# EAGLE board avr32break120828 (EAGLE 5.11), part 1 of 2
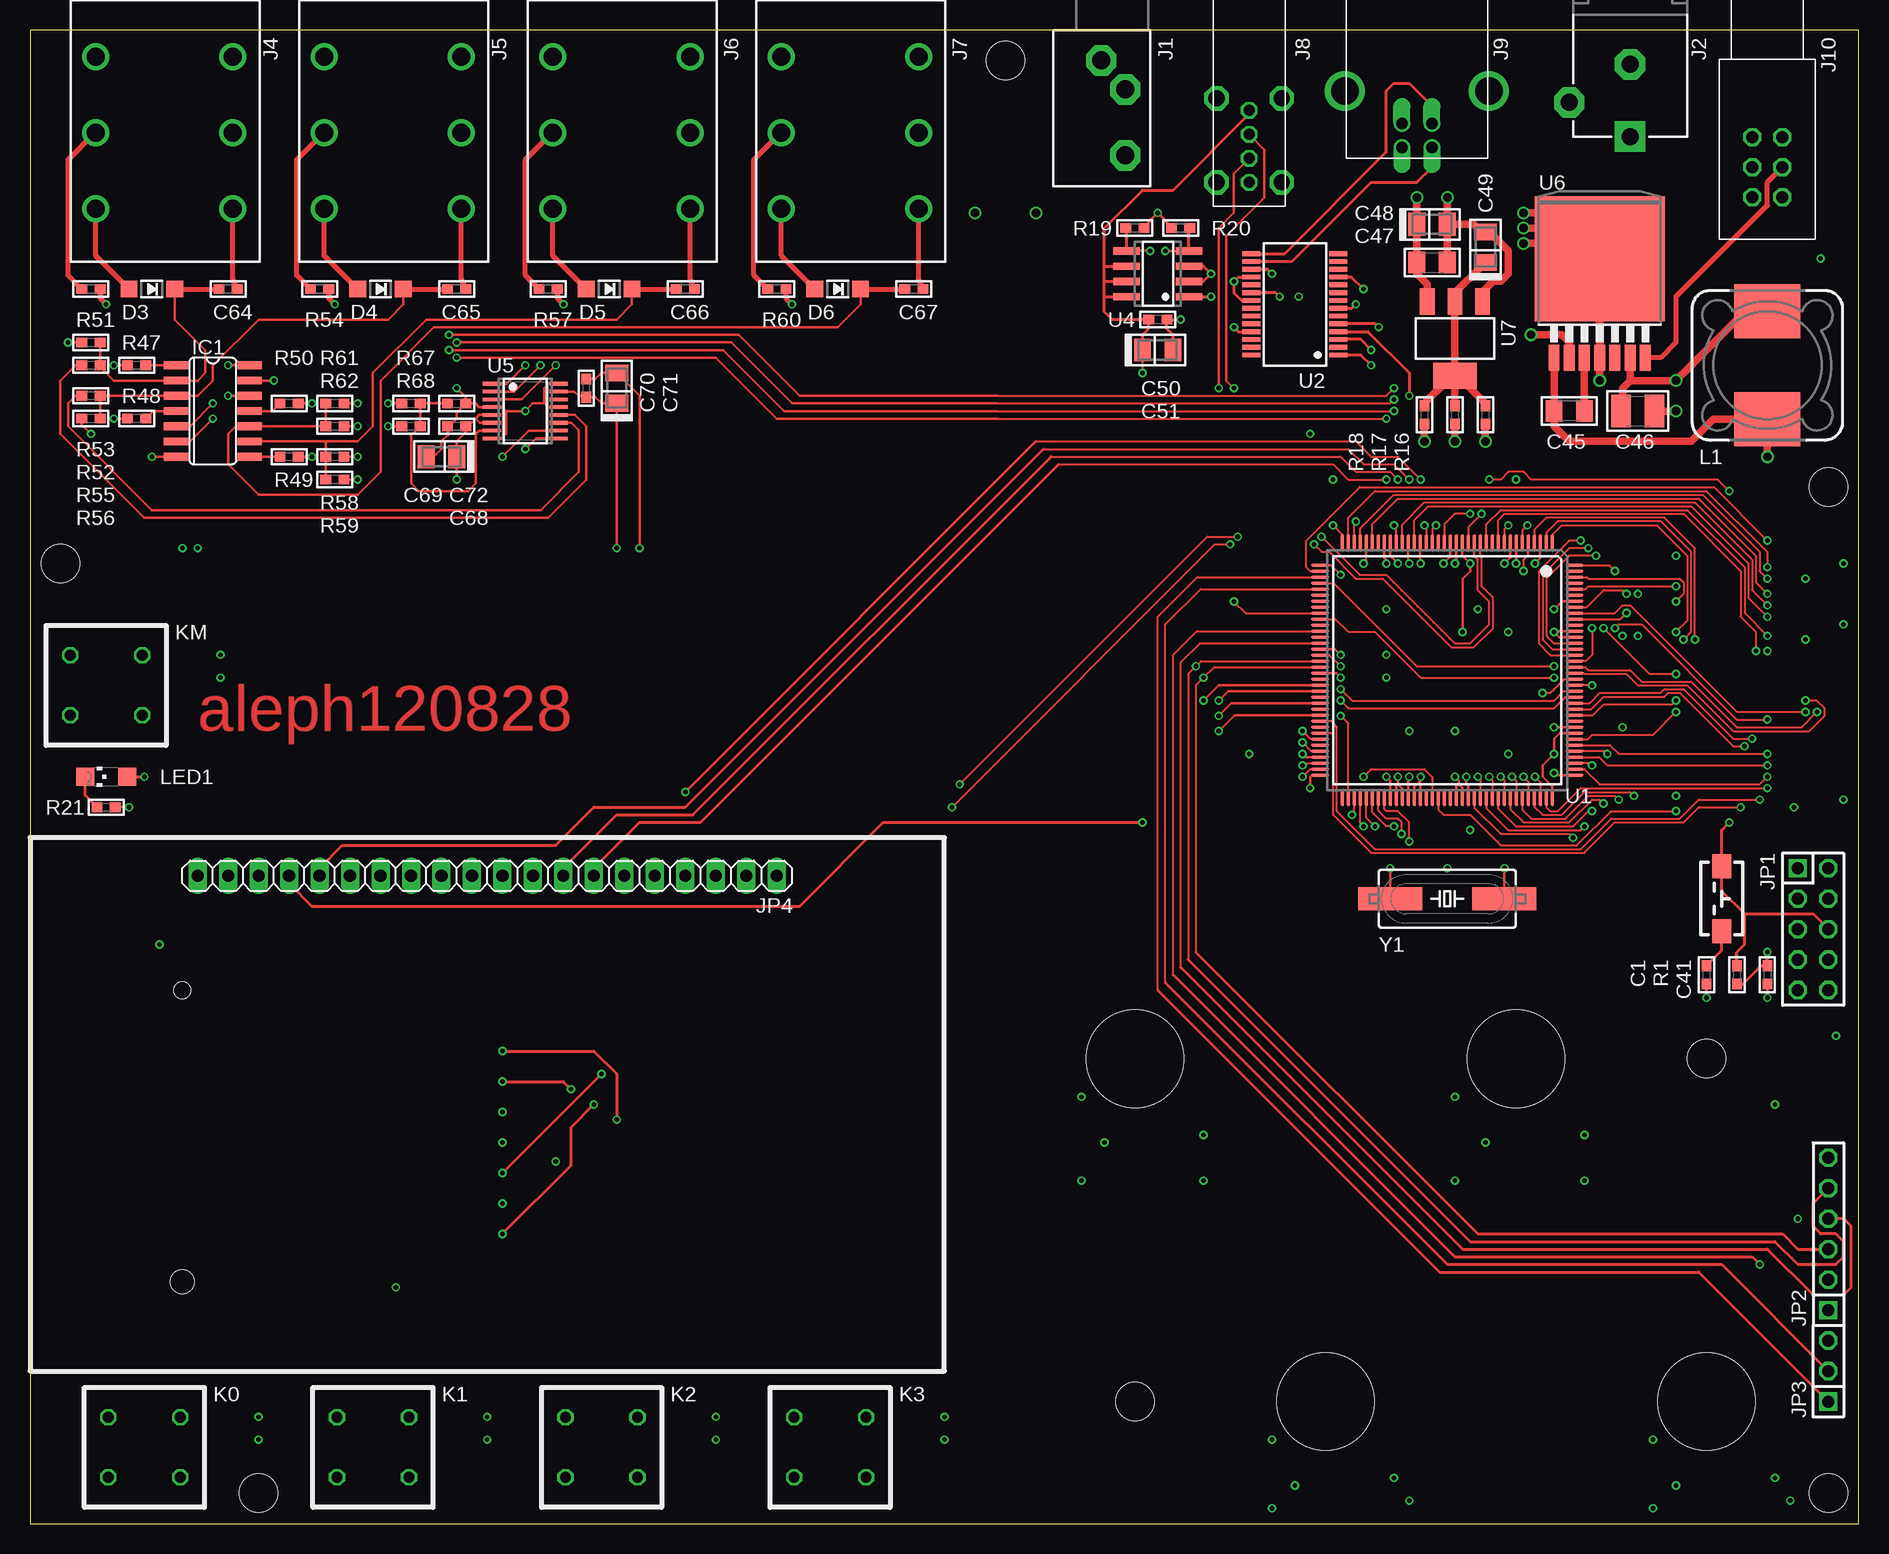
[diagram p3: board, top side]
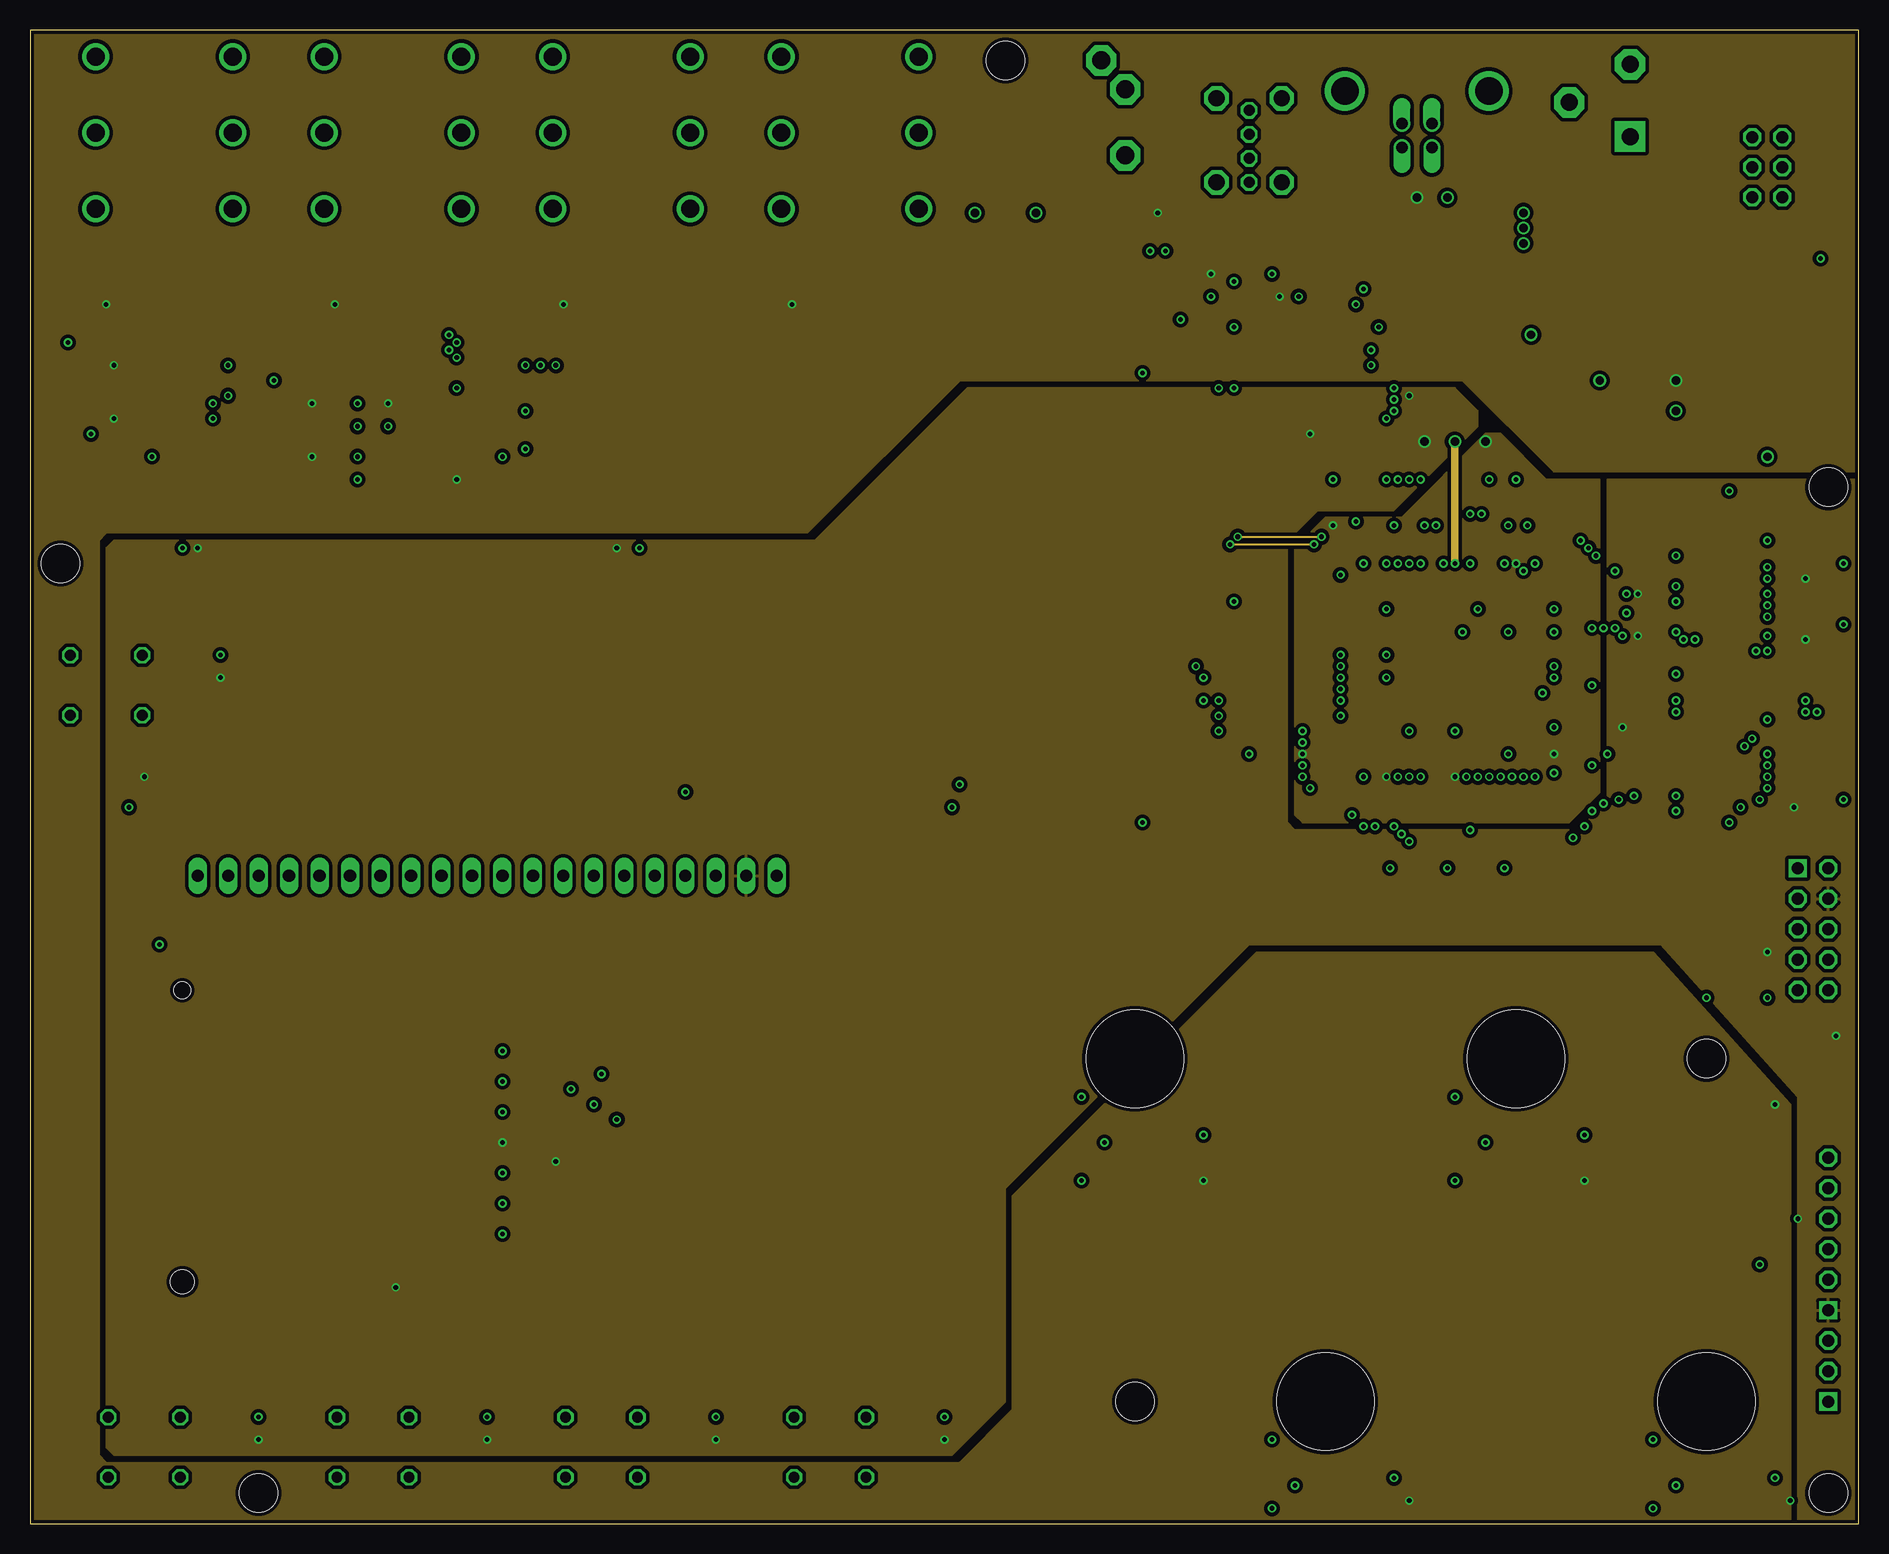
[diagram p4: board, inner layer Route2]
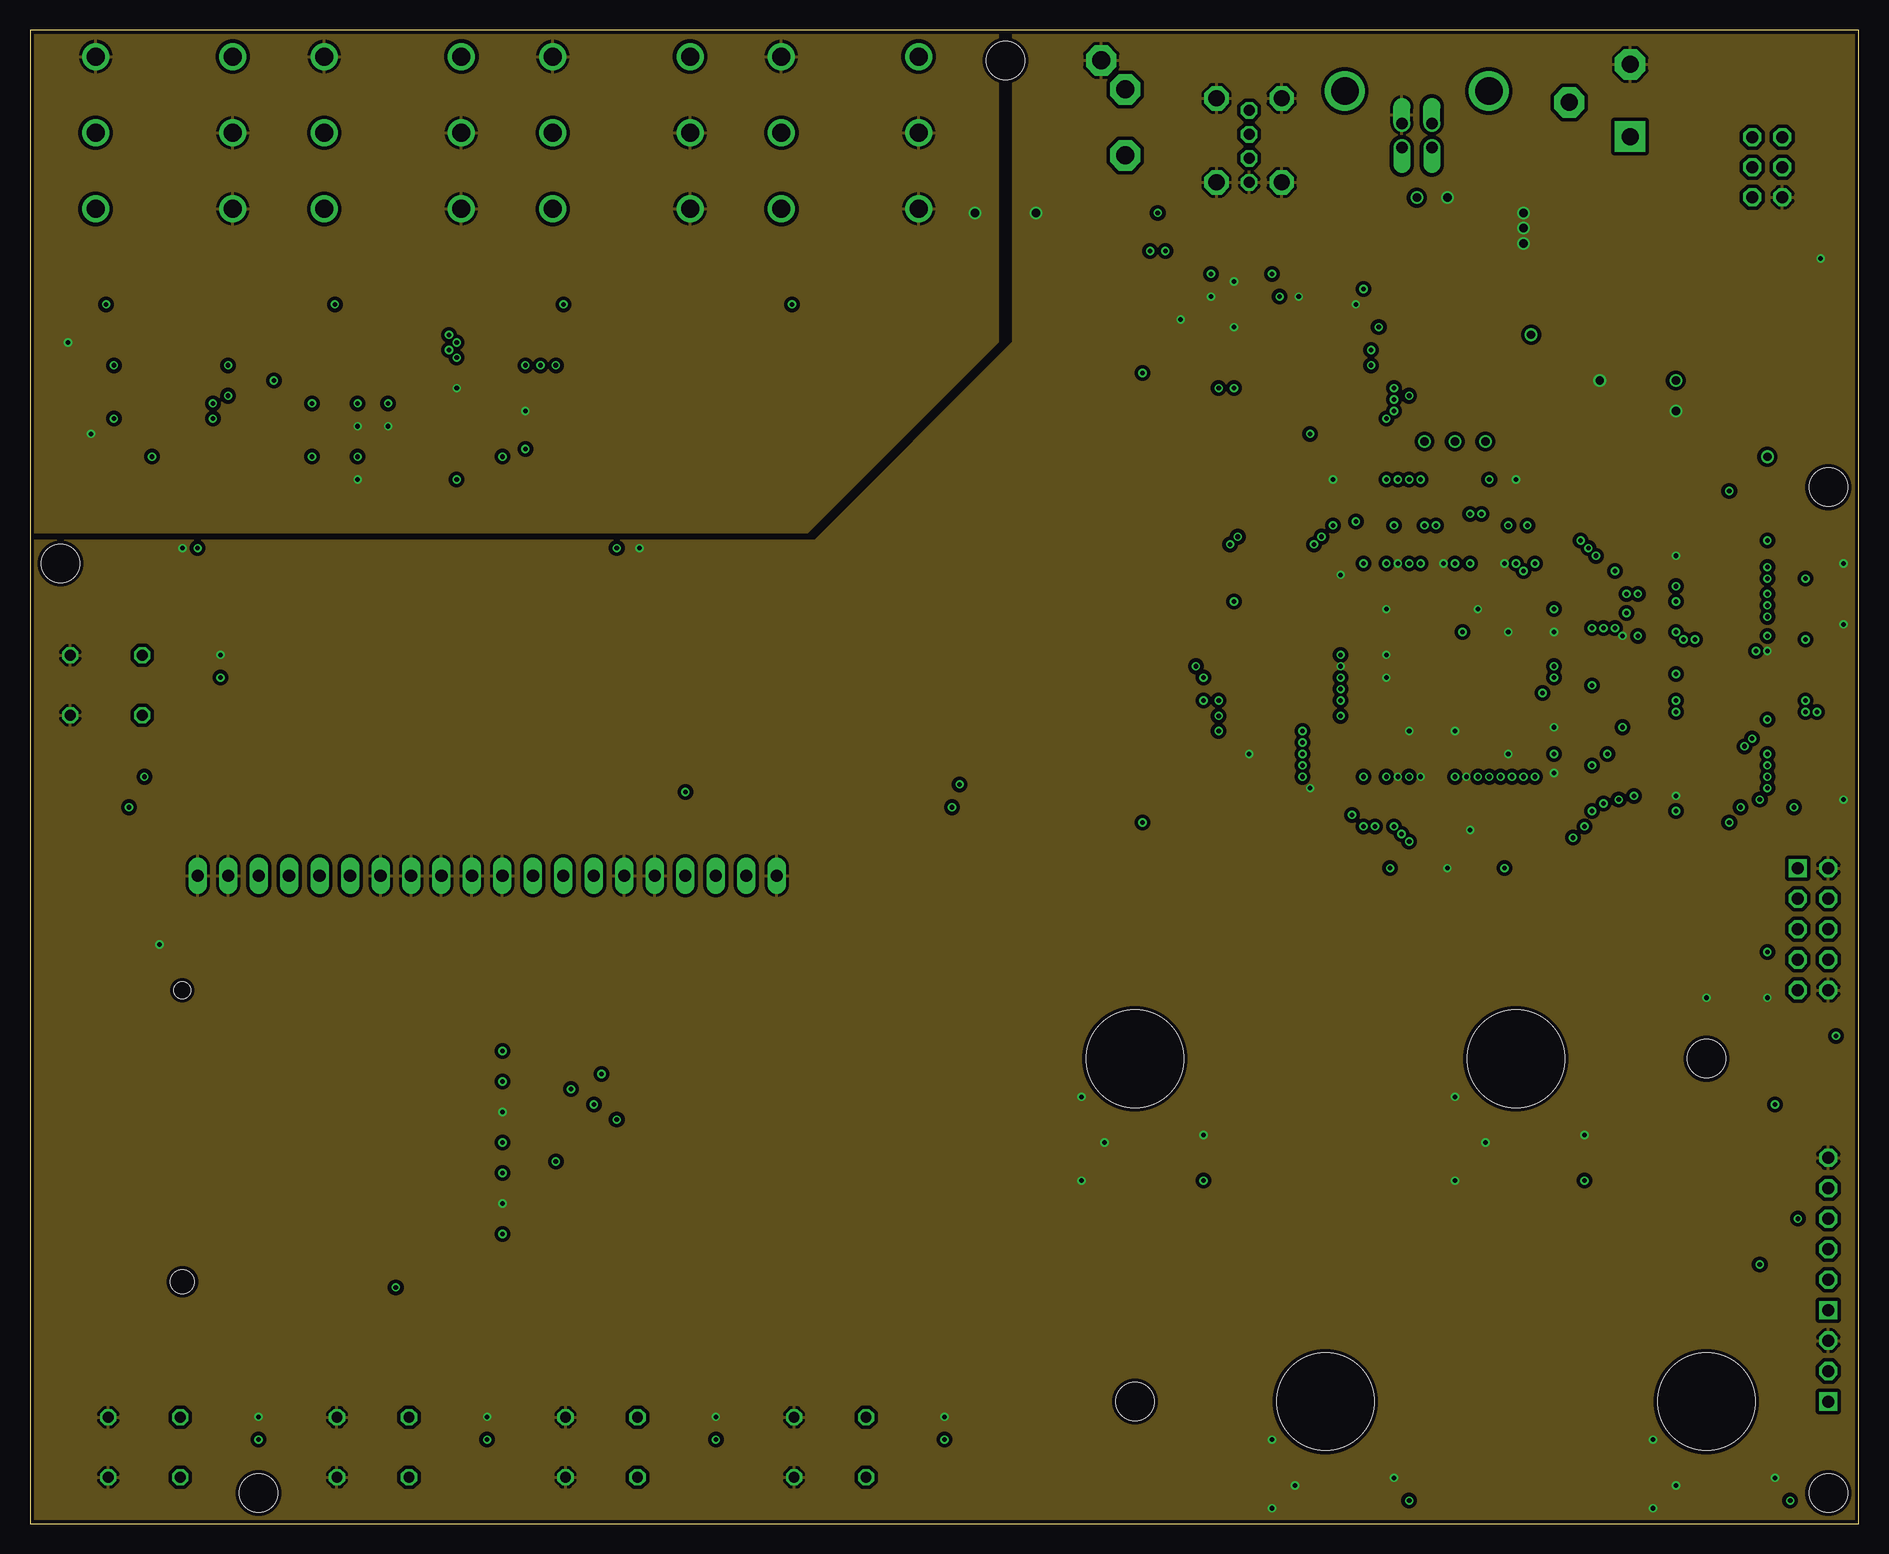
[diagram p5: board, inner layer Route3]
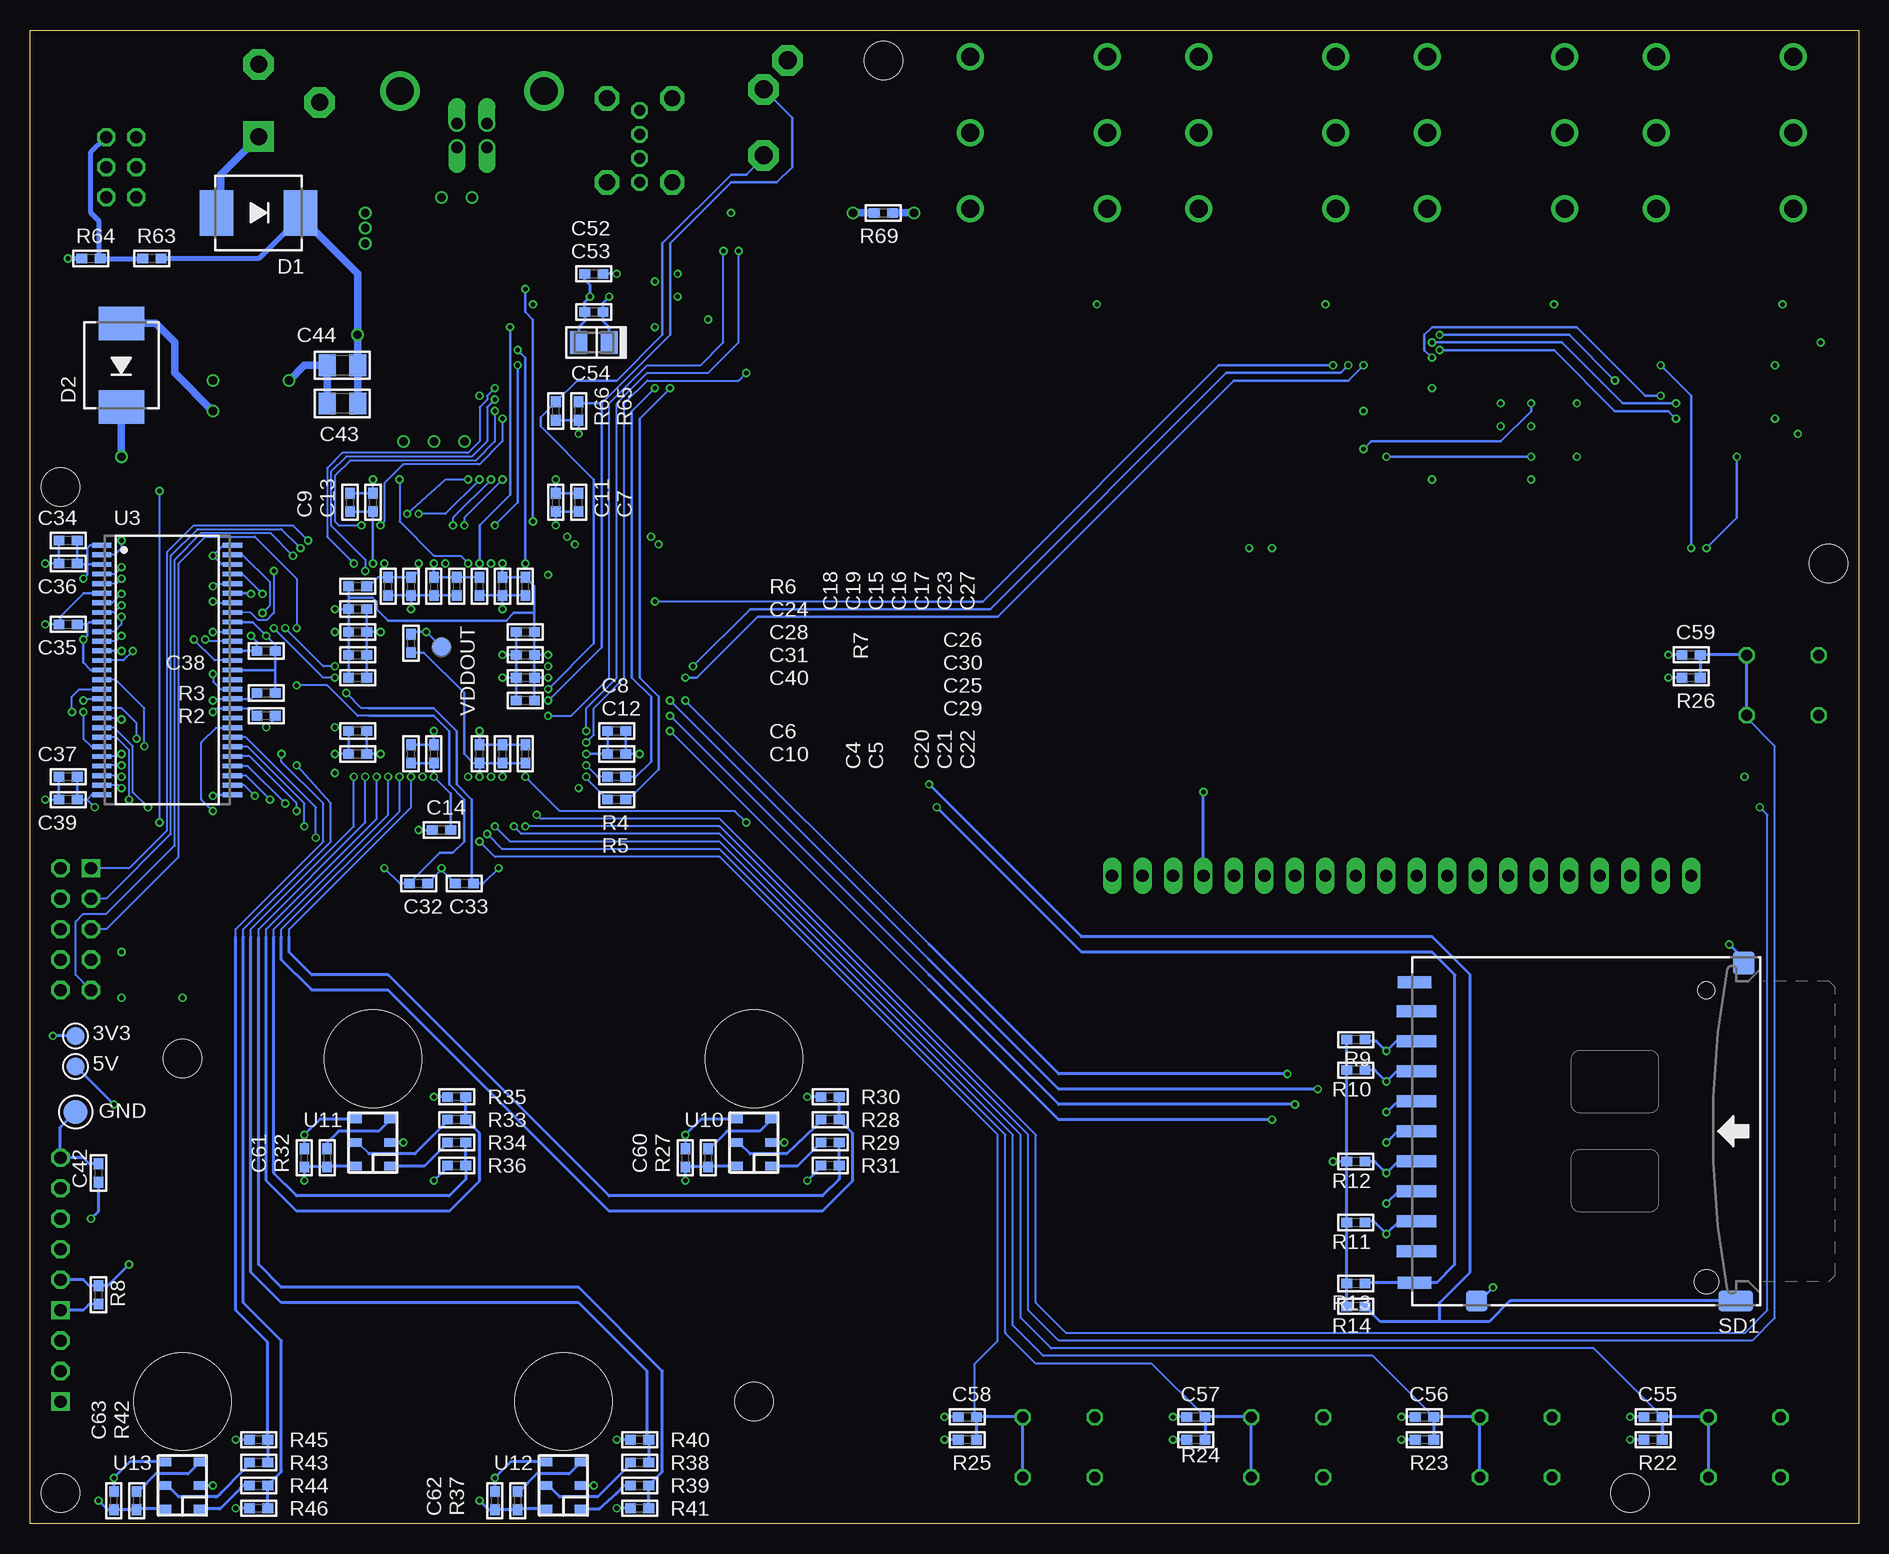
[diagram p6: board, bottom side, seen from below]

Size 152.4 x 124.46 mm. Coordinates in mm from the lower left corner, seen from the top.
Outline: 0,0 152.4,0 152.4,124.46 0,124.46 0,0
Copper layers (1*2+3*16): Top 0.035mm / dielectric 1.5mm / Route2 0.035mm / dielectric 0.15mm / Route3 0.035mm / dielectric 0.2mm / Bottom 0.035mm
Design rules "default *": minimum track width 6mil, minimum drill 15mil, track to track 6mil, track to pad 6mil, pad to pad 6mil, via to via 6mil, smd to smd 6mil, copper to edge 10mil, drill to drill 8mil, minimum pad ring 6mil, minimum via ring 6mil, stop-mask expansion 4mil, vias tented up to drill 0mil, thermal gap 10mil
Holes 8.13 mm at 92.08,38.73 123.83,38.73 107.95,10.16 139.7,10.16
Holes 3.2 mm at 149.86,2.54 19.05,2.54 2.54,80.01 81.28,121.92 149.86,86.36 92.08,10.16 139.7,38.73

## Footprints (pad centres in the part's own frame; a part is rotated, then mirrored left to right if it is on the bottom)
SMD-15R = smd 1.5 x 1.5: TP 0,0
C0603 = smd 0.9 x 0.8: 1 -0.762,0; 2 0.762,0
C1206 = smd 1.4 x 1.8: 1 -1.27,0; 2 1.27,0
C3225 = smd 1.6 x 2.7: 1 -1.397,0; 2 1.397,0
C1206/T = smd 1.4 x 1.9: + 1.27,0; - -1.27,0
SMC = smd 2.8 x 3.8: A 3.493,0; C -3.493,0
SOD123 = smd 1.4 x 1.4: A 1.905,0; C -1.905,0
SMD-20R = smd 2 x 2: TP 0,0
SO14 = smd 0.66 x 2.032: 1 -3.81,-3.073; 2 -2.54,-3.073; 3 -1.27,-3.073; 4 0,-3.073; 5 1.27,-3.073; 6 2.54,-3.073; 7 3.81,-3.073; 8 3.81,3.073; 9 2.54,3.073; 10 1.27,3.073; 11 0,3.073; 12 -1.27,3.073; 13 -2.54,3.073; 14 -3.81,3.073
SJ1-3533NG = drill 1.5 pad 2.54 octagon: 1 0,-0.9; 2 2.4,1.1; 3 7.9,1.1
PJ-102XH = drill 1.422 pad 2.54 square: 1 0,0 | drill 1.422 pad 2.54 octagon: 2 0,-6.032; 3 5.08,-2.857
NEUTRIK-NRJ6HM-1 = drill 1.5 round: R 7.23,11.1; RN -4.2,11.1; S 7.23,4.75; SN -4.2,4.75; T 7.23,17.45; TN -4.2,17.45
USBA-VERT = drill 0.92 octagon: 1 0,-6; 2 0,-4; 3 0,-2; 4 0,0 | drill 1.35 octagon: G1 -2.72,0; G2 -2.72,-7; G3 2.72,-7; G4 2.72,0
USB_B = drill 0.95 offset: DM -1.25,4.71; DP -1.25,2.71; GND 1.25,2.71; VCC 1.25,4.71 | drill 2.3 round: MOUNT1 -6,0; MOUNT2 6,0
PHA2U = drill 1 octagon: 0 -1.25,0; 1 -1.25,-2.5; 2 -1.25,2.5; _0 1.25,0; _1 1.25,-2.5; _2 1.25,2.5
AVR-JTAG-10 = drill 1.016 square: 1 -5.08,-1.27 | drill 1.016 octagon: 2 -5.08,1.27; 3 -2.54,-1.27; 4 -2.54,1.27; 5 0,-1.27; 6 0,1.27; 7 2.54,-1.27; 8 2.54,1.27; 9 5.08,-1.27; 10 5.08,1.27
1X06 = drill 1.016 square: 1 -6.35,0 | drill 1.016 octagon: 2 -3.81,0; 3 -1.27,0; 4 1.27,0; 5 3.81,0; 6 6.35,0
1X03 = drill 1.016 square: 1 -2.54,0 | drill 1.016 octagon: 2 0,0; 3 2.54,0
1X20 = drill 1.016 long: 1 -24.13,0; 2 -21.59,0; 3 -19.05,0; 4 -16.51,0; 5 -13.97,0; 6 -11.43,0; 7 -8.89,0; 8 -6.35,0; 9 -3.81,0; 10 -1.27,0; 11 1.27,0; 12 3.81,0; 13 6.35,0; 14 8.89,0; 15 11.43,0; 16 13.97,0; 17 16.51,0; 18 19.05,0; 19 21.59,0; 20 24.13,0
PVA1 = drill 0.9 octagon: 1 -3,-2.5; 2 -3,2.5; 3 3,2.5; 4 3,-2.5
MSS1278 = smd 5.5 x 4.5: 1 0,4.5; 2 0,-4.5
CHIPLED_1206 = smd 1.5 x 1.5: A 0,-1.75; C 0,1.75
R0603 = smd 0.9 x 0.8: 1 -0.762,0; 2 0.762,0
SCDA1A0900 = smd 1 x 3.3: 1 -4.25,24.15; 2 -6.75,24.15; 3 -9.25,24.15; 4 -11.75,24.15; 5 -14.25,24.15; 6 -16.75,24.15; 7 -19.25,24.15; 8 -21.75,24.15; 9 -1.75,24.15 | smd 1 x 2.8: 10 -24.38,24.325; 13 0.675,24.325 | smd 1.7 x 1.8: 11 -25.9,19.15 | smd 1.7 x 2.9: 12 -25.9,-2.45 | smd 1.9 x 1.8: 14 2.25,-3.1 | hole 1.4: 0,0 | hole 2: -24.3,0
LQFP144 = smd 0.25 x 1.5: 1 -8.75,-10.6; 2 -8.25,-10.6; 3 -7.75,-10.6; 4 -7.25,-10.6; 5 -6.75,-10.6; 6 -6.25,-10.6; 7 -5.75,-10.6; 8 -5.25,-10.6; 9 -4.75,-10.6; 10 -4.25,-10.6; 11 -3.75,-10.6; 12 -3.25,-10.6; 13 -2.75,-10.6; 14 -2.25,-10.6; 15 -1.75,-10.6; 16 -1.25,-10.6; 17 -0.75,-10.6; 18 -0.25,-10.6; 19 0.25,-10.6; 20 0.75,-10.6; 21 1.25,-10.6; 22 1.75,-10.6; 23 2.25,-10.6; 24 2.75,-10.6; 25 3.25,-10.6; 26 3.75,-10.6; 27 4.25,-10.6; 28 4.75,-10.6; 29 5.25,-10.6; 30 5.75,-10.6; 31 6.25,-10.6; 32 6.75,-10.6; 33 7.25,-10.6; 34 7.75,-10.6; 35 8.25,-10.6; 36 8.75,-10.6; 73 8.75,10.6; 74 8.25,10.6; 75 7.75,10.6; 76 7.25,10.6; 77 6.75,10.6; 78 6.25,10.6; 79 5.75,10.6; 80 5.25,10.6; 81 4.75,10.6; 82 4.25,10.6; 83 3.75,10.6; 84 3.25,10.6; 85 2.75,10.6; 86 2.25,10.6; 87 1.75,10.6; 88 1.25,10.6; 89 0.75,10.6; 90 0.25,10.6; 91 -0.25,10.6; 92 -0.75,10.6; 93 -1.25,10.6; 94 -1.75,10.6; 95 -2.25,10.6; 96 -2.75,10.6; 97 -3.25,10.6; 98 -3.75,10.6; 99 -4.25,10.6; 100 -4.75,10.6; 101 -5.25,10.6; 102 -5.75,10.6; 103 -6.25,10.6; 104 -6.75,10.6; 105 -7.25,10.6; 106 -7.75,10.6; 107 -8.25,10.6; 108 -8.75,10.6 | smd 1.5 x 0.25: 37 10.6,-8.75; 38 10.6,-8.25; 39 10.6,-7.75; 40 10.6,-7.25; 41 10.6,-6.75; 42 10.6,-6.25; 43 10.6,-5.75; 44 10.6,-5.25; 45 10.6,-4.75; 46 10.6,-4.25; 47 10.6,-3.75; 48 10.6,-3.25; 49 10.6,-2.75; 50 10.6,-2.25; 51 10.6,-1.75; 52 10.6,-1.25; 53 10.6,-0.75; 54 10.6,-0.25; 55 10.6,0.25; 56 10.6,0.75; 57 10.6,1.25; 58 10.6,1.75; 59 10.6,2.25; 60 10.6,2.75; 61 10.6,3.25; 62 10.6,3.75; 63 10.6,4.25; 64 10.6,4.75; 65 10.6,5.25; 66 10.6,5.75; 67 10.6,6.25; 68 10.6,6.75; 69 10.6,7.25; 70 10.6,7.75; 71 10.6,8.25; 72 10.6,8.75; 109 -10.6,8.75; 110 -10.6,8.25; 111 -10.6,7.75; 112 -10.6,7.25; 113 -10.6,6.75; 114 -10.6,6.25; 115 -10.6,5.75; 116 -10.6,5.25; 117 -10.6,4.75; 118 -10.6,4.25; 119 -10.6,3.75; 120 -10.6,3.25; 121 -10.6,2.75; 122 -10.6,2.25; 123 -10.6,1.75; 124 -10.6,1.25; 125 -10.6,0.75; 126 -10.6,0.25; 127 -10.6,-0.25; 128 -10.6,-0.75; 129 -10.6,-1.25; 130 -10.6,-1.75; 131 -10.6,-2.25; 132 -10.6,-2.75; 133 -10.6,-3.25; 134 -10.6,-3.75; 135 -10.6,-4.25; 136 -10.6,-4.75; 137 -10.6,-5.25; 138 -10.6,-5.75; 139 -10.6,-6.25; 140 -10.6,-6.75; 141 -10.6,-7.25; 142 -10.6,-7.75; 143 -10.6,-8.25; 144 -10.6,-8.75
SSOP28 = smd 0.4 x 1.5: 1 -4.225,-3.625; 2 -3.575,-3.625; 3 -2.925,-3.625; 4 -2.275,-3.625; 5 -1.625,-3.625; 6 -0.975,-3.625; 7 -0.325,-3.625; 8 0.325,-3.625; 9 0.975,-3.625; 10 1.625,-3.625; 11 2.275,-3.625; 12 2.925,-3.625; 13 3.575,-3.625; 14 4.225,-3.625; 15 4.225,3.625; 16 3.575,3.625; 17 2.925,3.625; 18 2.275,3.625; 19 1.625,3.625; 20 0.975,3.625; 21 0.325,3.625; 22 -0.325,3.625; 23 -0.975,3.625; 24 -1.625,3.625; 25 -2.275,3.625; 26 -2.925,3.625; 27 -3.575,3.625; 28 -4.225,3.625
TSOP54 = smd 0.4 x 1.6: 1 -10.4,-5.45; 2 -9.6,-5.45; 3 -8.8,-5.45; 4 -8,-5.45; 5 -7.2,-5.45; 6 -6.4,-5.45; 7 -5.6,-5.45; 8 -4.8,-5.45; 9 -4,-5.45; 10 -3.2,-5.45; 11 -2.4,-5.45; 12 -1.6,-5.45; 13 -0.8,-5.45; 14 0,-5.45; 15 0.8,-5.45; 16 1.6,-5.45; 17 2.4,-5.45; 18 3.2,-5.45; 19 4,-5.45; 20 4.8,-5.45; 21 5.6,-5.45; 22 6.4,-5.45; 23 7.2,-5.45; 24 8,-5.45; 25 8.8,-5.45; 26 9.6,-5.45; 27 10.4,-5.45; 28 10.4,5.45; 29 9.6,5.45; 30 8.8,5.45; 31 8,5.45; 32 7.2,5.45; 33 6.4,5.45; 34 5.6,5.45; 35 4.8,5.45; 36 4,5.45; 37 3.2,5.45; 38 2.4,5.45; 39 1.6,5.45; 40 0.8,5.45; 41 0,5.45; 42 -0.8,5.45; 43 -1.6,5.45; 44 -2.4,5.45; 45 -3.2,5.45; 46 -4,5.45; 47 -4.8,5.45; 48 -5.6,5.45; 49 -6.4,5.45; 50 -7.2,5.45; 51 -8,5.45; 52 -8.8,5.45; 53 -9.6,5.45; 54 -10.4,5.45
SO08 = smd 0.6 x 2.2: 1 -1.905,-2.6; 2 -0.635,-2.6; 3 0.635,-2.6; 4 1.905,-2.6; 5 1.905,2.6; 6 0.635,2.6; 7 -0.635,2.6; 8 -1.905,2.6
TSSOP16 = smd 0.3 x 1.5: 1 -2.275,-2.8; 2 -1.625,-2.8; 3 -0.975,-2.8; 4 -0.325,-2.8; 5 0.325,-2.8; 6 0.975,-2.8; 7 1.625,-2.8; 8 2.275,-2.8; 9 2.275,2.8; 10 1.625,2.8; 11 0.975,2.8; 12 0.325,2.8; 13 -0.325,2.8; 14 -0.975,2.8; 15 -1.625,2.8; 16 -2.275,2.8
TO263-7 = smd 0.914 x 2.159: 1 -3.81,-5.715; 2 -2.54,-5.715; 3 -1.27,-5.715; 4 0,-5.715; 5 1.27,-5.715; 6 2.54,-5.715; 7 3.81,-5.715 | smd 10.8 x 10.41: 8 0,2.54
SOT223 = smd 1.219 x 2.235: 1 -2.311,-3.099; 2 0,-3.099; 3 2.311,-3.099 | smd 3.6 x 2.2: 4 0,3.099
AEDR8300 = smd 1.08 x 0.72: 1 -1.48,1.96; 2 -1.48,0; 3 -1.48,-1.96; 4 1.48,-1.96; 5 1.48,0; 6 1.48,1.96
PANASONIC-EVQ = smd 2 x 1.6: 1 2.7,0; 2 -2.7,0
SMD-15RN = smd 1.5 x 1.5: TP 0,0
HC49UP = smd 5.334 x 1.93: 1 -4.763,0; 2 4.763,0

## Placement (x,y rotation side)
3V3  TPS-SMD-15R  [SMD-15R]  148.59,40.64 0 bottom
5V  TPS-SMD-15R  [SMD-15R]  148.59,38.1 0 bottom
C1  100n  [C0603]  139.7,45.72 270 top
C4  100n  [C0603]  120.65,64.14 90 bottom
C5  33n  [C0603]  118.75,64.14 90 bottom
C6  100n  [C0603]  125.09,66.04 0 bottom
C7  100n  [C0603]  106.68,85.09 90 bottom
C8  100n  [C0603]  103.5,66.04 0 bottom
C9  100n  [C0603]  125.73,85.09 90 bottom
C10  33n  [C0603]  125.09,64.14 0 bottom
C11  33n  [C0603]  108.58,85.09 90 bottom
C12  33n  [C0603]  103.5,64.14 0 bottom
C13  33n  [C0603]  123.83,85.09 90 bottom
C14  4.7u  [C0603]  118.11,57.78 180 bottom
C15  33n  [C0603]  118.75,78.11 270 bottom
C16  100n  [C0603]  116.84,78.11 270 bottom
C17  4.7u  [C0603]  114.94,78.11 270 bottom
C18  2.2u  [C0603]  122.56,78.11 270 bottom
C19  470p  [C0603]  120.65,78.11 270 bottom
C20  2.7n  [C0603]  114.94,64.14 90 bottom
C21  33n  [C0603]  113.03,64.14 90 bottom
C22  2.2u  [C0603]  111.12,64.14 90 bottom
C23  2.7n  [C0603]  113.03,78.11 270 bottom
C24  2.7n  [C0603]  125.09,76.2 0 bottom
C25  2.7n  [C0603]  111.12,70.48 180 bottom
C26  2.7n  [C0603]  111.12,74.3 180 bottom
C27  33n  [C0603]  111.12,78.11 270 bottom
C28  33n  [C0603]  125.09,74.3 0 bottom
C29  33n  [C0603]  111.12,68.58 180 bottom
C30  33n  [C0603]  111.12,72.39 180 bottom
C31  100n  [C0603]  125.09,72.39 0 bottom
C32  22p  [C0603]  120.02,53.34 0 bottom
C33  22p  [C0603]  116.2,53.34 180 bottom
C34  4.7u  [C0603]  149.22,81.92 180 bottom
C35  100n  [C0603]  149.22,74.93 180 bottom
C36  33n  [C0603]  149.22,80.01 180 bottom
C37  100n  [C0603]  149.22,62.23 180 bottom
C38  33n  [C0603]  132.72,72.71 0 bottom
C39  4.7u  [C0603]  149.22,60.33 180 bottom
C40  2.2u  [C0603]  125.09,70.48 0 bottom
C41  100n  [C0603]  144.78,45.72 270 top
C42  100n  [C0603]  146.69,29.21 90 bottom
C43  22u  [C1206]  126.36,93.34 0 bottom
C44  470n  [C1206]  126.36,96.52 0 bottom
C45  10n  [C1206]  128.27,92.71 0 top
C46  47u  [C3225]  133.99,92.71 0 top
C47  100n  [C1206]  116.84,105.09 180 top
C48  10u  [C1206/T]  116.84,108.27 180 top
C49  10u  [C1206/T]  121.28,106.36 270 top
C50  100n  [C0603]  93.98,100.33 180 top
C51  4.7u  [C1206/T]  93.98,97.79 180 top
C52  100n  [C0603]  105.41,104.14 0 bottom
C53  100n  [C0603]  105.41,100.97 0 bottom
C54  4.7u  [C1206/T]  105.41,98.42 0 bottom
C55  100n  [C0603]  17.14,8.89 0 bottom
C56  100n  [C0603]  36.2,8.89 0 bottom
C57  100n  [C0603]  55.24,8.89 0 bottom
C58  100n  [C0603]  74.3,8.89 0 bottom
C59  100n  [C0603]  13.97,72.39 0 bottom
C60  100n  [C0603]  97.79,30.48 270 bottom
C61  100n  [C0603]  129.54,30.48 270 bottom
C62  100n  [C0603]  113.67,1.91 270 bottom
C63  100n  [C0603]  145.41,1.91 270 bottom
C64  10n  [C0603]  16.51,102.87 0 top
C65  10n  [C0603]  35.56,102.87 0 top
C66  10n  [C0603]  54.61,102.87 0 top
C67  10n  [C0603]  73.66,102.87 0 top
C68  100n  [C0603]  35.56,91.44 0 top
C69  10u  [C1206/T]  34.29,88.9 0 top
C70  100n  [C0603]  46.35,94.61 270 top
C71  10u  [C1206/T]  48.9,94.61 270 top
C72  100n  [C0603]  35.56,93.34 180 top
D1  MBRS360T3  [SMC]  133.35,109.22 180 bottom
D2  MBRS360T3  [SMC]  144.78,96.52 90 bottom
D3  1N4148W-7  [SOD123]  10.16,102.87 180 top
D4  1N4148W-7  [SOD123]  29.21,102.87 180 top
D5  1N4148W-7  [SOD123]  48.26,102.87 180 top
D6  1N4148W-7  [SOD123]  67.31,102.87 180 top
GND  TPS-SMD-20R  [SMD-20R]  148.59,34.29 0 bottom
IC1  4066D  [SO14]  15.24,92.71 270 top
J1  SJ1-3533NG  [SJ1-3533NG]  90.17,121.92 270 top
J2  PJ-102AH/BH  [PJ-102XH]  133.35,115.57 180 top
J4  STEREOSW2GND  [NEUTRIK-NRJ6HM-1]  12.7,127 180 top
J5  STEREOSW2GND  [NEUTRIK-NRJ6HM-1]  31.75,127 180 top
J6  STEREOSW2GND  [NEUTRIK-NRJ6HM-1]  50.8,127 180 top
J7  STEREOSW2GND  [NEUTRIK-NRJ6HM-1]  69.85,127 180 top
J8  USBA-VERT  [USBA-VERT]  101.6,111.76 180 top
J9  [USB_B]  115.57,119.38 180 top
J10  PHA2U  [PHA2U]  144.78,113.03 180 top
JP1  AVR-JTAG  [AVR-JTAG-10]  148.59,49.53 270 top
JP2  BF-SPI  [1X06]  149.86,24.13 90 top
JP3  BF-IO  [1X03]  149.86,12.7 90 top
JP4  OLED  [1X20]  38.1,53.98 180 top
K0  PVA1  [PVA1]  9.53,6.35 0 top
K1  PVA1  [PVA1]  28.57,6.35 0 top
K2  PVA1  [PVA1]  47.62,6.35 0 top
K3  PVA1  [PVA1]  66.67,6.35 0 top
KM  PVA1  [PVA1]  6.35,69.85 0 top
L1  MSS1278  [MSS1278]  144.78,96.52 180 top
LED1  [CHIPLED_1206]  6.35,62.23 90 top
R1  10k  [R0603]  142.24,45.72 270 top
R2  4.7k  [R0603]  132.72,67.31 0 bottom
R3  4.7k  [R0603]  132.72,69.22 0 bottom
R4  39  [R0603]  103.5,62.23 0 bottom
R5  39  [R0603]  103.5,60.33 0 bottom
R6  0  [R0603]  125.09,78.11 180 bottom
R7  0  [R0603]  120.65,73.34 270 bottom
R8  100k  [R0603]  146.69,19.05 270 bottom
R9  100k  [R0603]  41.91,40.32 180 bottom
R10  100k  [R0603]  41.91,37.78 180 bottom
R11  100k  [R0603]  41.91,25.08 180 bottom
R12  100k  [R0603]  41.91,30.16 180 bottom
R13  100k  [R0603]  41.91,20 180 bottom
R14  100k  [R0603]  41.91,18.1 180 bottom
R16  0  [R0603]  121.28,92.39 90 top
R17  0  [R0603]  118.75,92.39 90 top
R18  0  [R0603]  116.2,92.39 90 top
R19  47k  [R0603]  92.08,107.95 0 top
R20  47k  [R0603]  95.89,107.95 180 top
R21  150  [R0603]  6.35,59.69 180 top
R22  10k  [R0603]  17.14,6.99 0 bottom
R23  10k  [R0603]  36.2,6.99 0 bottom
R24  10k  [R0603]  55.24,6.99 0 bottom
R25  10k  [R0603]  74.3,6.99 0 bottom
R26  10k  [R0603]  13.97,70.48 0 bottom
R27  220  [R0603]  95.89,30.48 90 bottom
R28  470  [R0603]  85.72,33.66 0 bottom
R29  470  [R0603]  85.72,31.75 0 bottom
R30  910  [R0603]  85.72,35.56 0 bottom
R31  910  [R0603]  85.72,29.84 0 bottom
R32  220  [R0603]  127.64,30.48 90 bottom
R33  470  [R0603]  116.84,33.66 0 bottom
R34  470  [R0603]  116.84,31.75 0 bottom
R35  910  [R0603]  116.84,35.56 0 bottom
R36  910  [R0603]  116.84,29.84 0 bottom
R37  220  [R0603]  111.76,1.91 90 bottom
R38  470  [R0603]  101.6,5.08 0 bottom
R39  470  [R0603]  101.6,3.17 0 bottom
R40  910  [R0603]  101.6,6.99 0 bottom
R41  910  [R0603]  101.6,1.27 0 bottom
R42  220  [R0603]  143.51,1.91 90 bottom
R43  470  [R0603]  133.35,5.08 0 bottom
R44  470  [R0603]  133.35,3.17 0 bottom
R45  910  [R0603]  133.35,6.99 0 bottom
R46  910  [R0603]  133.35,1.27 0 bottom
R47  10k  [R0603]  8.89,96.52 0 top
R48  10k  [R0603]  8.89,92.08 0 top
R49  10k  [R0603]  21.59,88.9 180 top
R50  10k  [R0603]  21.59,93.34 180 top
R51  10k  [R0603]  5.08,102.87 0 top
R52  10k  [R0603]  5.08,96.52 0 top
R53  10k  [R0603]  5.08,98.42 180 top
R54  10k  [R0603]  24.13,102.87 0 top
R55  10k  [R0603]  5.08,93.98 0 top
R56  10k  [R0603]  5.08,92.08 180 top
R57  10k  [R0603]  43.18,102.87 0 top
R58  10k  [R0603]  25.4,88.9 180 top
R59  10k  [R0603]  25.4,87 0 top
R60  10k  [R0603]  62.23,102.87 0 top
R61  10k  [R0603]  25.4,93.34 180 top
R62  10k  [R0603]  25.4,91.44 0 top
R63  330k  [R0603]  142.24,105.41 0 bottom
R64  100k  [R0603]  147.32,105.41 180 bottom
R65  10k  [R0603]  106.68,92.71 90 bottom
R66  10k  [R0603]  108.58,92.71 90 bottom
R67  10k  [R0603]  31.75,93.34 0 top
R68  10k  [R0603]  31.75,91.44 180 top
R69  0  [R0603]  81.28,109.22 180 bottom
SD1  SCDA1A0900_SPI  [SCDA1A0900]  12.7,44.45 90 bottom
U1  AT32UC3A0512  [LQFP144]  118.11,71.12 180 top
U2  FT232RL  [SSOP28]  105.41,101.6 90 top
U3  MT48LC4M16A2P  [TSOP54]  140.97,71.12 270 bottom
U4  TPS2020  [SO08]  93.98,104.14 90 top
U5  AD7923  [TSSOP16]  41.27,92.71 270 top
U6  LM2678  [TO263-7]  130.81,102.87 0 top
U7  ADP3339  [SOT223]  118.75,98.74 180 top
U10  AEDR8300P  [AEDR8300]  92.08,31.75 180 bottom
U11  AEDR8300P  [AEDR8300]  123.83,31.75 180 bottom
U12  AEDR8300P  [AEDR8300]  107.95,3.17 180 bottom
U13  AEDR8300P  [AEDR8300]  139.7,3.17 180 bottom
U$1  PANASONIC-EVQ  [PANASONIC-EVQ]  140.97,52.07 270 top
VDDOUT  TPS-SMD-15RN  [SMD-15RN]  118.11,73.03 180 bottom
Y1  12mhz  [HC49UP]  118.11,52.07 0 top